# Altium schematic sheet LORA-MODULE.SchDoc
size A
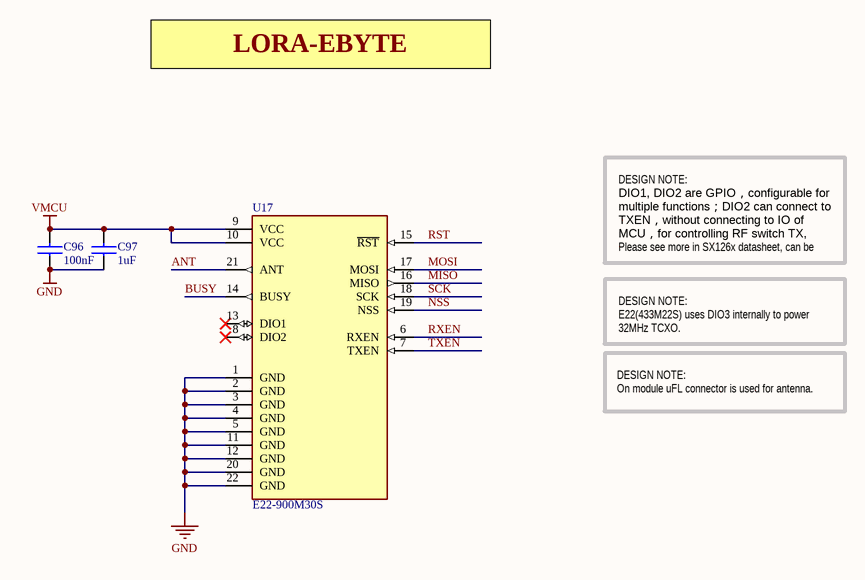
[diagram p0: LORA-MODULE.SchDoc]

## Parts
C96  100nF  [CAP0603]
C97  1uF  [CAP0603]
U17  E22-900M30S  [E22-900M30S]

## Nets
GND: C96.1 C97.1 U17.1(GND) U17.2(GND) U17.3(GND) U17.4(GND) U17.5(GND) U17.11(GND) U17.12(GND) U17.20(GND) U17.22(GND)
VMCU: C96.2 C97.2 U17.9(VCC) U17.10(VCC)
ANT: U17.21(ANT)
BUSY: U17.14(BUSY)
MISO: U17.16(MISO)
MOSI: U17.17(MOSI)
NSS: U17.19(NSS)
RST: U17.15(~{RST})
RXEN: U17.6(RXEN)
SCK: U17.18(SCK)
TXEN: U17.7(TXEN)

Not connected (* = marked no-connect by the designer): U17 8(DIO2)* 13(DIO1)*

## Notes on the sheet
- LORA-EBYTE
- DESIGN NOTE:
  DIO1, DIO2 are GPIO，configurable for multiple functions；DIO2 can connect to TXEN，without connecting to IO of MCU，for controlling RF switch TX, Please see more in SX126x datasheet, can be floated when free.
- DESIGN NOTE:
  E22(433M22S) uses DIO3 internally to power 32MHz TCXO.
- DESIGN NOTE:
  On module uFL connector is used for antenna.

## Library data of the parts
C96 = C - 100nF: MURATA - GRM188R71C104KA01J - CAP, MLCC, X7R, 0.1UF, 16V, 0603; IRNAS Part No.: I-200005; Ceramic Capacitor Case: 0603 [1608 Metric]; Capacitance: 0.1; Voltage Rating: 16; Capacitance Tolerance: ± 10%; Dielectric Characteristic: X7; Product Range: GRM Series; SVHC: No SVHC (20-Jun-2016; Supplier 1: Farnell; Manufacturer: MURATA; Manufacturer Part Number: GRM188R71C104KA01J; RoHS: YES; Stock 1: 18297; Pricing 1: 10=0.0145, 100=0.0126, 500=0.0081, 2500=0.0059, 5000=0.0052, 10000=0.0046, 50000=0.0036, 100000=0.0035 (GBP); Packaging: Cut Tape; Operating Temperature Min: -55; Operating Temperature Max: 125; Automotive Qualification Standard: -; MSL: MSL 1 - Unlimited; ComponentLink1URL: http://www.farnell.com/datasheets/2189124.pdf; ComponentLink1Description: http://www.farnell.com/datasheets/2189124.pdf; Supplier Part Number 1: 2688519
C97 = C - 1uF: MURATA - GRM188R61H105KAALD - CAP, MLCC, X5R, 1UF, 50V, 0603; IRNAS Part No.: I-200006; Ceramic Capacitor Case: 0603 [1608 Metric]; Capacitance: 1; Voltage Rating: 50; Capacitance Tolerance: ± 10%; Dielectric Characteristic: X5; Product Range: GRM Series; SVHC: No SVHC (17-Dec-2015); Capacitor Terminals: SMD<!--FANDB--><div class="features-and-benefits-container"><div class="features-and-benefits-description"><span class="features-benefits-value">The Murata GRM series capacitors are Multilayer Ceramic Chip Capacitors (MLCC) used for general purpose applications. These MLCC capacitors are classified into temperature compensating and high dielectric constant types depending on the change in electrostatic capacitance due to change in temperature. The temperature compensating capacitors feature a small rate of change in electrostatic capacitance as the temperature changes and are used for applications such as filters and high frequency circuit matching. The high dielectric constant capacitors use materials with a high dielectric constant and feature a large electrostatic capacitance. Typical applications are power supply decoupling and smoothing circuits.</span></div><div class="features-and-benefits-list"><ul class="features-and-benefits-list-list"><li class="features-and-benefits-list-item">Large capacity and small size in a multilayer structure</li><li class="features-and-benefits-list-item">Capacitance value ranging from 0.1pF to 220?F</li><li class="features-and-benefits-list-item">Tin plated external electrodes, excellent solderability</li><li class="features-and-benefits-list-item">Provides good high frequency characteristics</li><li class="features-and-benefits-list-item">Excellent pulse response</li><li class="features-and-benefits-list-item">High reliability</li><li class="features-and-benefits-list-item">Capacitor size varies from 0.4×0.2mm to 5.7×5.0mm</li><li class="features-and-benefits-list-item">Rated voltage of 2.5VDC to 3.15; Supplier 1: Farnell; Manufacturer: MURATA; Manufacturer Part Number: GRM188R61H105KAALD; RoHS: YES; Stock 1: 62682; Pricing 1: 10=0.093, 100=0.062, 500=0.0507, 1000=0.0465, 2000=0.0429, 4000=0.0399, 20000=0.0372, 40000=0.0365 (GBP); Packaging: Cut Tape; Operating Temperature Min: -55; Operating Temperature Max: 85; Automotive Qualification Standard: -; MSL: -; Capacitance Tolerance ±: ± 10%; ComponentLink1URL: http://www.farnell.com/datasheets/2048611.pdf; ComponentLink1Description: http://www.farnell.com/datasheets/2048611.pdf; Supplier Part Number 1: 1845736
U17 = E22-900M30S: SX1262 868/915 MHz 1w SPI LoRa Module; MF: EBYTE; Value: *; SnapEDA_Link: https://www.snapeda.com/parts/E22-900M30S/EBYTE/view-part/?ref=snap; Availability: Not in stock; Price: None; Check_prices: https://www.snapeda.com/parts/E22-900M30S/EBYTE/view-part/?ref=eda; Package: Package; MP: E22-900M30S